# Altium schematic sheet STM32H730_PINOUT.SchDoc
size C; SheetNumber: 5; SheetTotal: 12
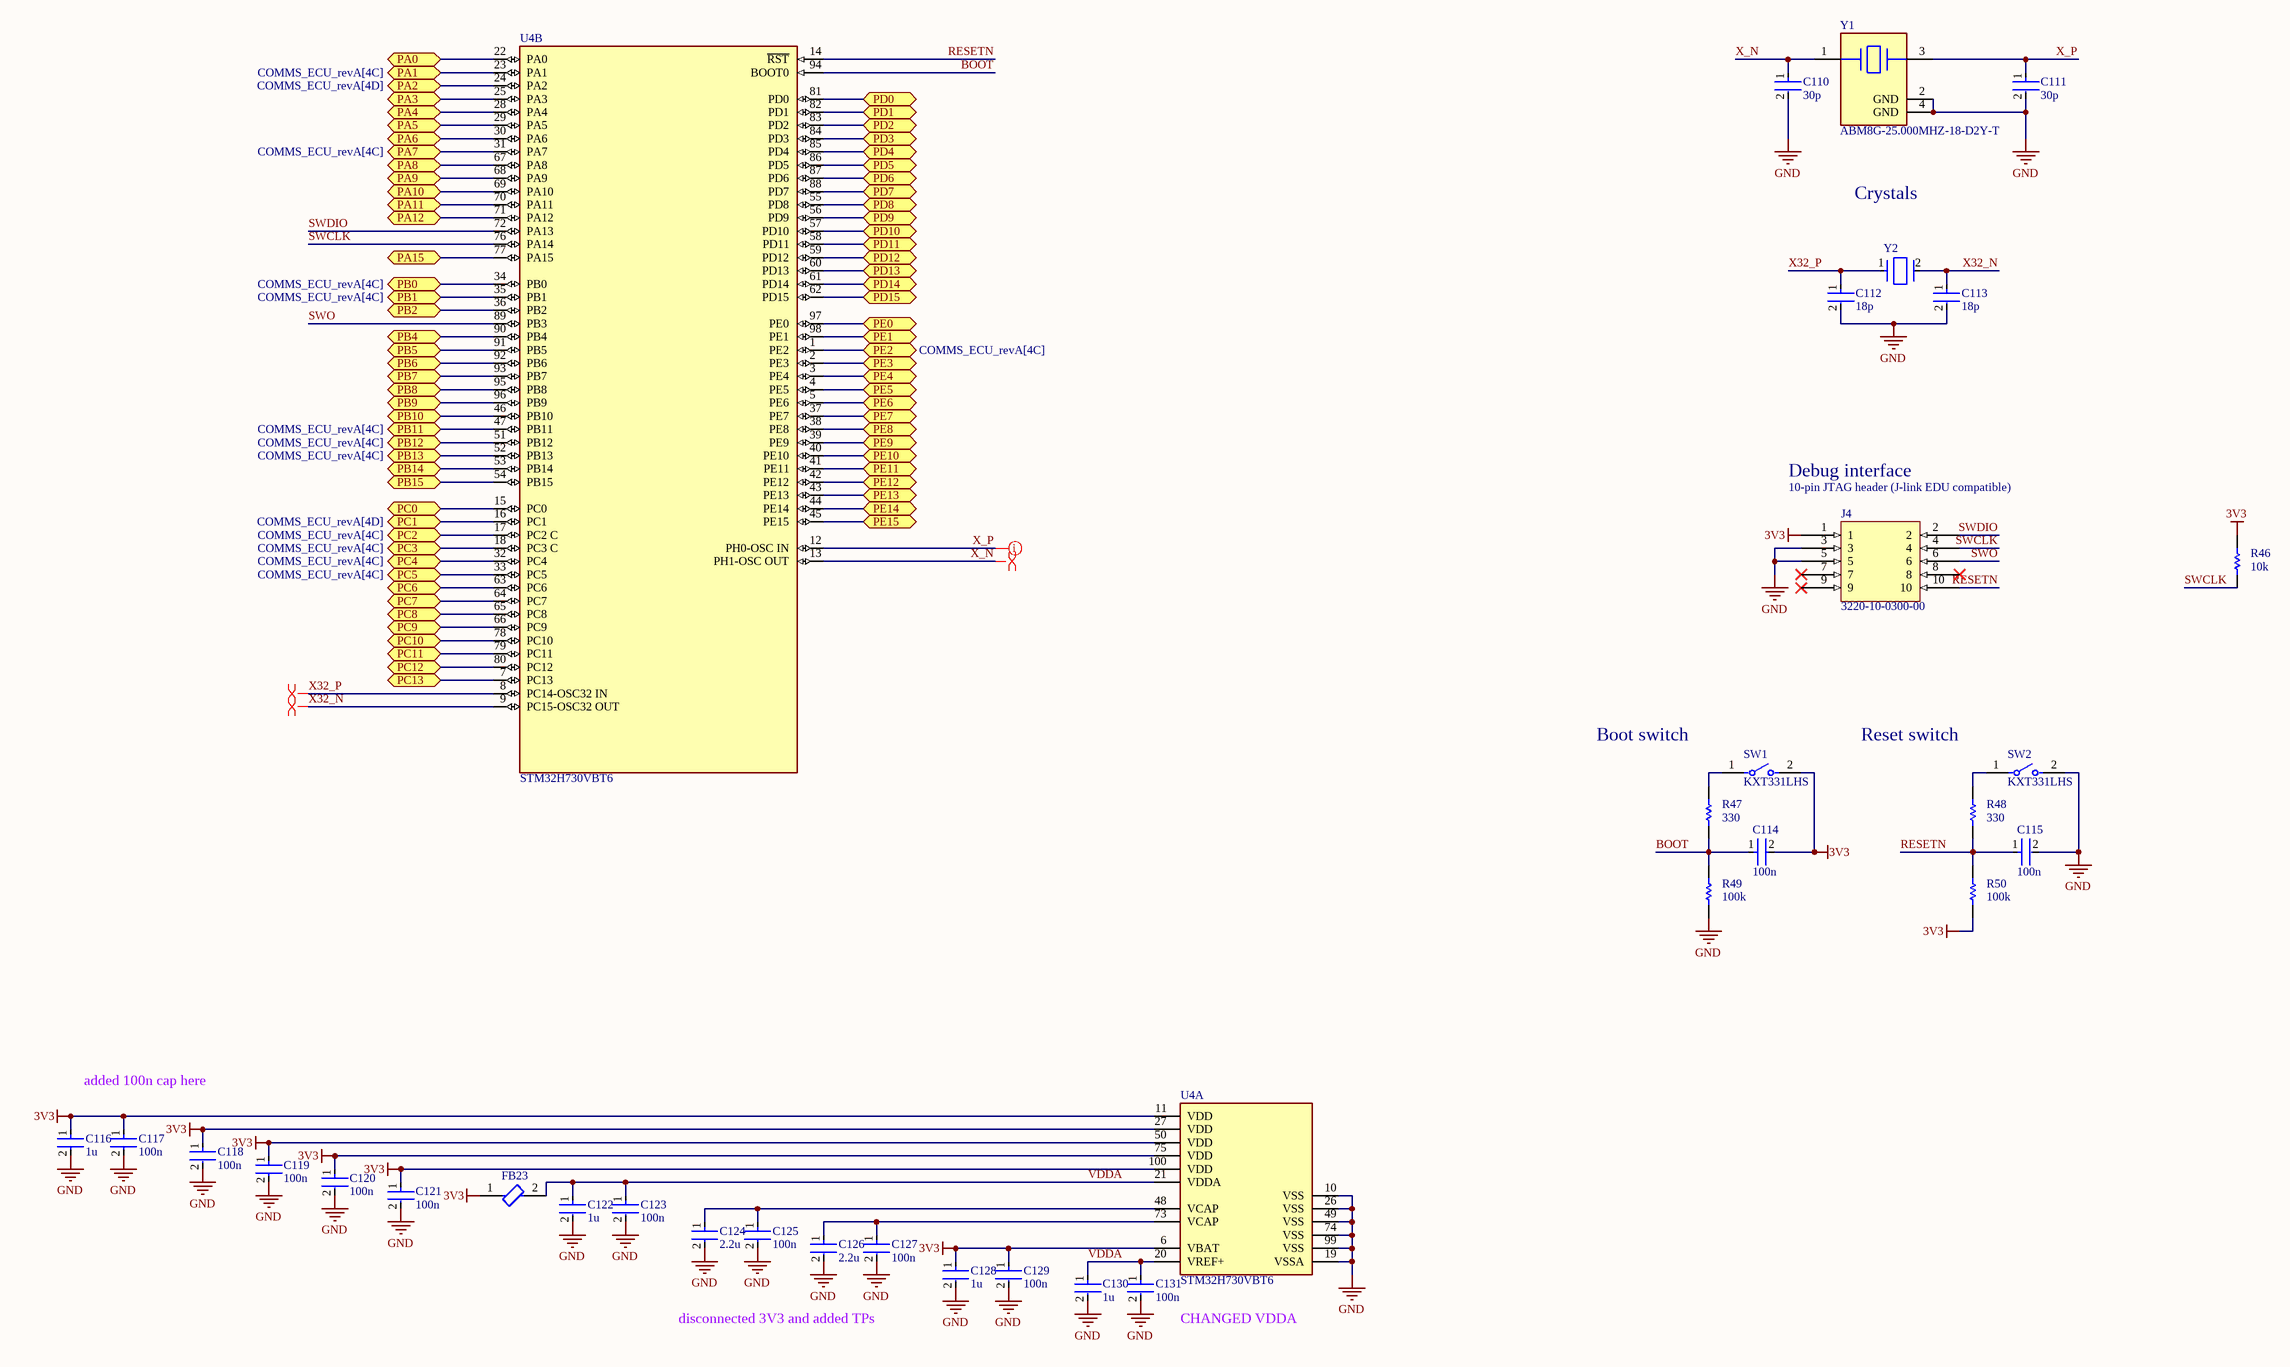
[diagram p0: STM32H730_PINOUT.SchDoc]

## Parts
C110  30p  [FP-0402-L_1_0_0_05-W_0_5-IPC_A]
C111  30p  [FP-0402-L_1_0_0_05-W_0_5-IPC_A]
C112  18p  [FP-0402-L_1_0_0_05-W_0_5-IPC_A]
C113  18p  [FP-0402-L_1_0_0_05-W_0_5-IPC_A]
C114  100n  [FP-0402-L_1_0_0_05-W_0_5-IPC_A]
C115  100n  [FP-0402-L_1_0_0_05-W_0_5-IPC_A]
C116  1u  [FP-0402-L_1_0_0_05-W_0_5-IPC_A]
C117  100n  [FP-0402-L_1_0_0_05-W_0_5-IPC_A]
C118  100n  [FP-0402-L_1_0_0_05-W_0_5-IPC_A]
C119  100n  [FP-0402-L_1_0_0_05-W_0_5-IPC_A]
C120  100n  [FP-0402-L_1_0_0_05-W_0_5-IPC_A]
C121  100n  [FP-0402-L_1_0_0_05-W_0_5-IPC_A]
C122  1u  [FP-0402-L_1_0_0_05-W_0_5-IPC_A]
C123  100n  [FP-0402-L_1_0_0_05-W_0_5-IPC_A]
C124  2.2u  [FP-0402-L_1_0_0_05-W_0_5-IPC_A]
C125  100n  [FP-0402-L_1_0_0_05-W_0_5-IPC_A]
C126  2.2u  [FP-0402-L_1_0_0_05-W_0_5-IPC_A]
C127  100n  [FP-0402-L_1_0_0_05-W_0_5-IPC_A]
C128  1u  [FP-0402-L_1_0_0_05-W_0_5-IPC_A]
C129  100n  [FP-0402-L_1_0_0_05-W_0_5-IPC_A]
C130  1u  [FP-0402-L_1_0_0_05-W_0_5-IPC_A]
C131  100n  [FP-0402-L_1_0_0_05-W_0_5-IPC_A]
FB23  BLM15PX601SN1D  [FP-BLM15-0_05-IPC_A]  (value not drawn)
J4  3220-10-0300-00  [3220-10-0300-00-Footprint-1]
R46  10k  [R0603B]
R47  330  [R0603B]
R48  330  [R0603B]
R49  100k  [R0603B]
R50  100k  [R0603B]
SW1  KXT331LHS  [FP-KXT331LHS-MFG]
SW2  KXT331LHS  [FP-KXT331LHS-MFG]
U4  STM32H730VBT6  [FP-LQFP100-1L-IPC_C]  (parts A,B of 2)
Y1  ABM8G-25.000MHZ-18-D2Y-T  [FP-ABM8G-MFG]
Y2  ECS-.327-12.5-1210-TR  [FP-ECX-1210-MFG]  (value not drawn)

## Ports
PA0 (bidir), PA1 (bidir, see COMMS_ECU_revA[4C]), PA2 (bidir, see COMMS_ECU_revA[4D]), PA3 (bidir), PA4 (bidir), PA5 (bidir), PA6 (bidir), PA7 (bidir, see COMMS_ECU_revA[4C]), PA8 (bidir), PA9 (bidir), PA10 (bidir), PA11 (bidir), PA12 (bidir), PA15 (bidir), PB0 (bidir, see COMMS_ECU_revA[4C]), PB1 (bidir, see COMMS_ECU_revA[4C]), PB2 (bidir), PB4 (bidir), PB5 (bidir), PB6 (bidir), PB7 (bidir), PB8 (bidir), PB9 (bidir), PB10 (bidir), PB11 (bidir, see COMMS_ECU_revA[4C]), PB12 (bidir, see COMMS_ECU_revA[4C]), PB13 (bidir, see COMMS_ECU_revA[4C]), PB14 (bidir), PB15 (bidir), PC0 (bidir), PC1 (bidir, see COMMS_ECU_revA[4D]), PC2 (bidir, see COMMS_ECU_revA[4C]), PC3 (bidir, see COMMS_ECU_revA[4C]), PC4 (bidir, see COMMS_ECU_revA[4C]), PC5 (bidir, see COMMS_ECU_revA[4C]), PC6 (bidir), PC7 (bidir), PC8 (bidir), PC9 (bidir), PC10 (bidir), PC11 (bidir), PC12 (bidir), PC13 (bidir), PD0 (bidir), PD1 (bidir), PD2 (bidir), PD3 (bidir), PD4 (bidir), PD5 (bidir), PD6 (bidir), PD7 (bidir), PD8 (bidir), PD9 (bidir), PD10 (bidir), PD11 (bidir), PD12 (bidir), PD13 (bidir), PD14 (bidir), PD15 (bidir), PE0 (bidir), PE1 (bidir), PE2 (bidir, see COMMS_ECU_revA[4C]), PE3 (bidir), PE4 (bidir), PE5 (bidir), PE6 (bidir), PE7 (bidir), PE8 (bidir), PE9 (bidir), PE10 (bidir), PE11 (bidir), PE12 (bidir), PE13 (bidir), PE14 (bidir), PE15 (bidir)

## Nets
3V3: C114.2 C116.1 C117.1 C118.1 C119.1 C120.1 C121.1 C128.1 C129.1 FB23.1 J4.1 R46.2 R50.1 SW1.2 U4.6(VBAT) U4.11(VDD) U4.27(VDD) U4.50(VDD) U4.75(VDD) U4.100(VDD)
GND: C110.2 C111.2 C112.2 C113.2 C115.2 C116.2 C117.2 C118.2 C119.2 C120.2 C121.2 C122.2 C123.2 C124.2 C125.2 C126.2 C127.2 C128.2 C129.2 C130.2 C131.2 J4.3 J4.5 R49.1 SW2.2 U4.10(VSS) U4.19(VSSA) U4.26(VSS) U4.49(VSS) U4.74(VSS) U4.99(VSS) Y1.2(GND) Y1.4(GND)
BOOT: C114.1 R47.1 R49.2 U4.94(BOOT0)
PA0: U4.22(PA0) ; port PA0
PA1: U4.23(PA1) ; port PA1
PA2: U4.24(PA2) ; port PA2
PA3: U4.25(PA3) ; port PA3
PA4: U4.28(PA4) ; port PA4
PA5: U4.29(PA5) ; port PA5
PA6: U4.30(PA6) ; port PA6
PA7: U4.31(PA7) ; port PA7
PA8: U4.67(PA8) ; port PA8
PA9: U4.68(PA9) ; port PA9
PA10: U4.69(PA10) ; port PA10
PA11: U4.70(PA11) ; port PA11
PA12: U4.71(PA12) ; port PA12
PA15: U4.77(PA15) ; port PA15
PB0: U4.34(PB0) ; port PB0
PB1: U4.35(PB1) ; port PB1
PB2: U4.36(PB2) ; port PB2
PB4: U4.90(PB4) ; port PB4
PB5: U4.91(PB5) ; port PB5
PB6: U4.92(PB6) ; port PB6
PB7: U4.93(PB7) ; port PB7
PB8: U4.95(PB8) ; port PB8
PB9: U4.96(PB9) ; port PB9
PB10: U4.46(PB10) ; port PB10
PB11: U4.47(PB11) ; port PB11
PB12: U4.51(PB12) ; port PB12
PB13: U4.52(PB13) ; port PB13
PB14: U4.53(PB14) ; port PB14
PB15: U4.54(PB15) ; port PB15
PC0: U4.15(PC0) ; port PC0
PC1: U4.16(PC1) ; port PC1
PC2: U4.17(PC2_C) ; port PC2
PC3: U4.18(PC3_C) ; port PC3
PC4: U4.32(PC4) ; port PC4
PC5: U4.33(PC5) ; port PC5
PC6: U4.63(PC6) ; port PC6
PC7: U4.64(PC7) ; port PC7
PC8: U4.65(PC8) ; port PC8
PC9: U4.66(PC9) ; port PC9
PC10: U4.78(PC10) ; port PC10
PC11: U4.79(PC11) ; port PC11
PC12: U4.80(PC12) ; port PC12
PC13: U4.7(PC13) ; port PC13
PD0: U4.81(PD0) ; port PD0
PD1: U4.82(PD1) ; port PD1
PD2: U4.83(PD2) ; port PD2
PD3: U4.84(PD3) ; port PD3
PD4: U4.85(PD4) ; port PD4
PD5: U4.86(PD5) ; port PD5
PD6: U4.87(PD6) ; port PD6
PD7: U4.88(PD7) ; port PD7
PD8: U4.55(PD8) ; port PD8
PD9: U4.56(PD9) ; port PD9
PD10: U4.57(PD10) ; port PD10
PD11: U4.58(PD11) ; port PD11
PD12: U4.59(PD12) ; port PD12
PD13: U4.60(PD13) ; port PD13
PD14: U4.61(PD14) ; port PD14
PD15: U4.62(PD15) ; port PD15
PE0: U4.97(PE0) ; port PE0
PE1: U4.98(PE1) ; port PE1
PE2: U4.1(PE2) ; port PE2
PE3: U4.2(PE3) ; port PE3
PE4: U4.3(PE4) ; port PE4
PE5: U4.4(PE5) ; port PE5
PE6: U4.5(PE6) ; port PE6
PE7: U4.37(PE7) ; port PE7
PE8: U4.38(PE8) ; port PE8
PE9: U4.39(PE9) ; port PE9
PE10: U4.40(PE10) ; port PE10
PE11: U4.41(PE11) ; port PE11
PE12: U4.42(PE12) ; port PE12
PE13: U4.43(PE13) ; port PE13
PE14: U4.44(PE14) ; port PE14
PE15: U4.45(PE15) ; port PE15
RESETN: C115.1 J4.10 R48.1 R50.2 U4.14(~{RST})
SWCLK: J4.4 R46.1 U4.76(PA14)
SWDIO: J4.2 U4.72(PA13)
SWO: J4.6 U4.89(PB3)
VDDA: C122.1 C123.1 C130.1 C131.1 FB23.2 U4.20(VREF+) U4.21(VDDA)
X32_N: C113.1 U4.9(PC15-OSC32_OUT) Y2.2(Out/In)
X32_P: C112.1 U4.8(PC14-OSC32_IN) Y2.1(In/Out)
X_N: C110.1 U4.13(PH1-OSC_OUT) Y1.1
X_P: C111.1 U4.12(PH0-OSC_IN) Y1.3
NetC124_1: C124.1 C125.1 U4.48(VCAP)
NetC126_1: C126.1 C127.1 U4.73(VCAP)
NetR47_2: R47.2 SW1.1
NetR48_2: R48.2 SW2.1

Not connected (* = marked no-connect by the designer): J4 7* 8* 9*

## Layout directives
differential pair: X32_N, X32_P, X_N, X_P

## Notes on the sheet
- Crystals
- Debug interface
- (near J4) 10-pin JTAG header (J-link EDU compatible)
- Boot switch
- Reset switch
- added 100n cap here
- disconnected 3V3 and added TPs
- CHANGED VDDA

## Library data of the parts
C110-C131 = CMP-001-00058-1: LARGE PADS, 0402 CAP, CHANGE COMMENT TO MATCH REAL P/N; Capacitor Type: Ceramic; Min Operating Temperature: -55°C; Mounting Technology: Surface Mount; Pins: 2; Case/Package: 0402; RoHS Compliant: Yes; Max Operating Temperature: 85°C
FB23 = CMP-0686-00252-4: Chip Ferrite Bead, 0402, 600Ω @ 100MHz, 0.23Ω, 25%, 900mA; Number of Circuits: 1; Impedance: 600R; DC Resistance (DCR): 230mR; Material: Steel; Length: 1mm; Package Quantity: 10000; Height: 0.5mm; Width: 0.5mm; Max DC Current: 900mA; Number of Lines: 1; Termination: SMD/SMT; Packaging: Tape and Reel; Lead Free: Lead Free; Min Operating Temperature: -55°C; Max Operating Temperature: 125°C; Max Current Rating: 900mA; Case Code (Imperial): 0402; Number of Pins: 2; Current Rating: 900mA; Test Frequency: 100MHz; Case/Package: 0402; Tolerance: 25%; Case Code (Metric): 1005
J4 = CMP-001-0013-3: CONN HEADER SMD 10POS 1.27MM
R46-R48 = CMP-009-00002-14: Resistor
  R46: Value: 10k
  R47 R48: Value: 330
R49 R50 = CMP-009-00002-14: Resistor; Value: 10k
SW1 SW2 = CMP-10040-000029-1: SWITCH TACTILE SPST-NO 0.02A 15V; Operating Force: 240gf; Switch Travel: 0.13mm; Illumination Type: Non-Illuminated; Throw Configuration: SPST; Number of Ports: 1; Current Rating: 5A; Mechanical Life: 500000Cycles; Switch Function: Off-Mom; Connector Type: USB; Actuator Type: Standard; Gender: Receptacle; Number of Contacts: 24; Contact Plating: Gold; Insulation Color: Black; Min Operating Temperature: -40°C; Packaging: Tape and Reel; Flammability Rating: UL94 V-0; Max Operating Temperature: 85°C; Termination: Solder; Mount: Surface Mount
U4 = CMP-12105-000107-1: IC MCU 32BIT 128KB FLASH 100LQFP
Y1 = CMP-2000-05733-3: Crystal 25MHz ±20ppm (Tol) ±30ppm (Stability) 18pF FUND 60Ω 4-Pin SMD T/R; Series Resistance: 60R; Length: 3.2mm; Depth: 2.5mm; Packaging: Tape and Reel; Min Operating Temperature: -40°C; Operating Frequency: 25 MHz; Lead Free: Lead Free; Number of Pins: 4; Frequency Tolerance: 20ppm; Radiation Hardening: No; Max Operating Temperature: 85°C; Termination: SMD/SMT; Frequency Stability: 30ppm; Frequency: 25MHz; Series: ABM8G; Mount: Surface Mount; Package Quantity: 1000; Height: 0.039inch; Width: 0.098inch; Case/Package: CSMD; ESR (Equivalent Series Resistance): 60R; Load Capacitance: 18pF; Tolerance: 20ppm
Y2 = CMP-40224-000006-1: CRYSTAL 32.7680KHZ 12.5PF SMD; Manufacturer: ECS International; Frequency: 32.768kHz; Esr: 90kΩ; Tolerance: 20ppm; Device Class L1: Passive Components; Load Capacitance: 12.5pF; Temperature: -40°C to +85°C; ComponentLink2URL: https://ecsxtal.com/store/pdf/ECX-1210.pdf; Series: ECX-1210; Octopart: https://octopart.com/ecs-.327-12.5-1210-tr-ecs+international-81221340; ComponentLink2Description: Datasheet; Temperature Range Low: -40°C; Digikey Description: CRYSTAL 32.7680KHZ 12.5PF SMD; Lead Free: Yes; RoHS: TRUE; Device Class L3: Crystals; Automotive: No; Category: Crys; Height: 0.5mm; Manufacturer Part Number: ECS-.327-12.5-1210-TR; Temperature Range High: +85°C; Device Class L2: Crystals / Oscillators; Package: ECX-1210